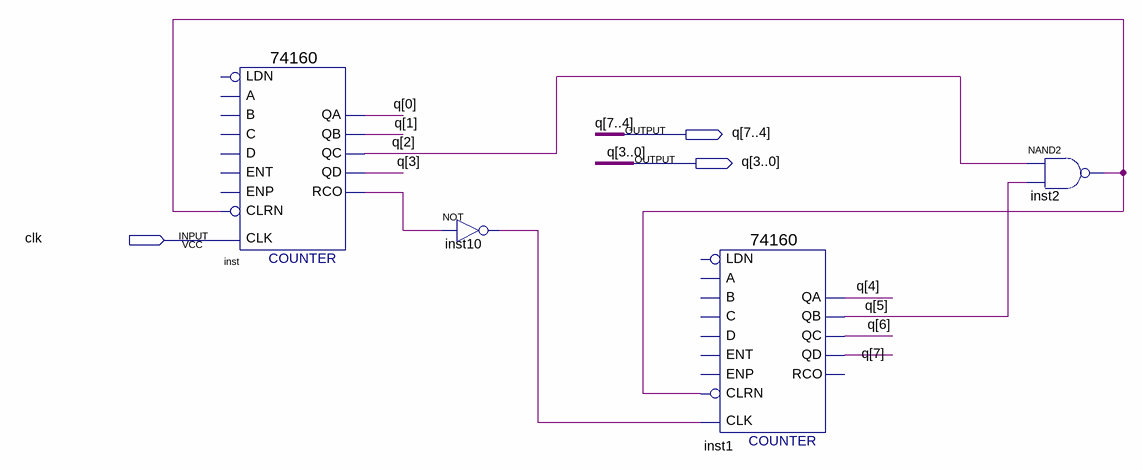
[diagram p0: schematic sheet]
// Quartus schematic counter_24_160.bdf as structural Verilog: 4 symbols, 3 pins
module counter_24_160 (
  input  clk,
  output [7:0] q
);

  wire inst2_out, inst10_out, inst_rco;

  \74160  inst (
    .CLK(clk), .CLRN(inst2_out), .QD(q[3]), .QA(q[0]), .QB(q[1]), .QC(q[2]), .RCO(inst_rco));  // open: ENT, A, B, C, D, LDN, ENP
  not inst10 (inst10_out, inst_rco);
  \74160  inst1 (
    .CLK(inst10_out), .CLRN(inst2_out), .QD(q[7]), .QA(q[4]), .QB(q[5]), .QC(q[6]));  // open: ENT, A, B, C, D, LDN, ENP, RCO
  nand inst2 (inst2_out, q[2], q[5]);
endmodule
